# EAGLE design BusConPoly (EAGLE 6.6.0)
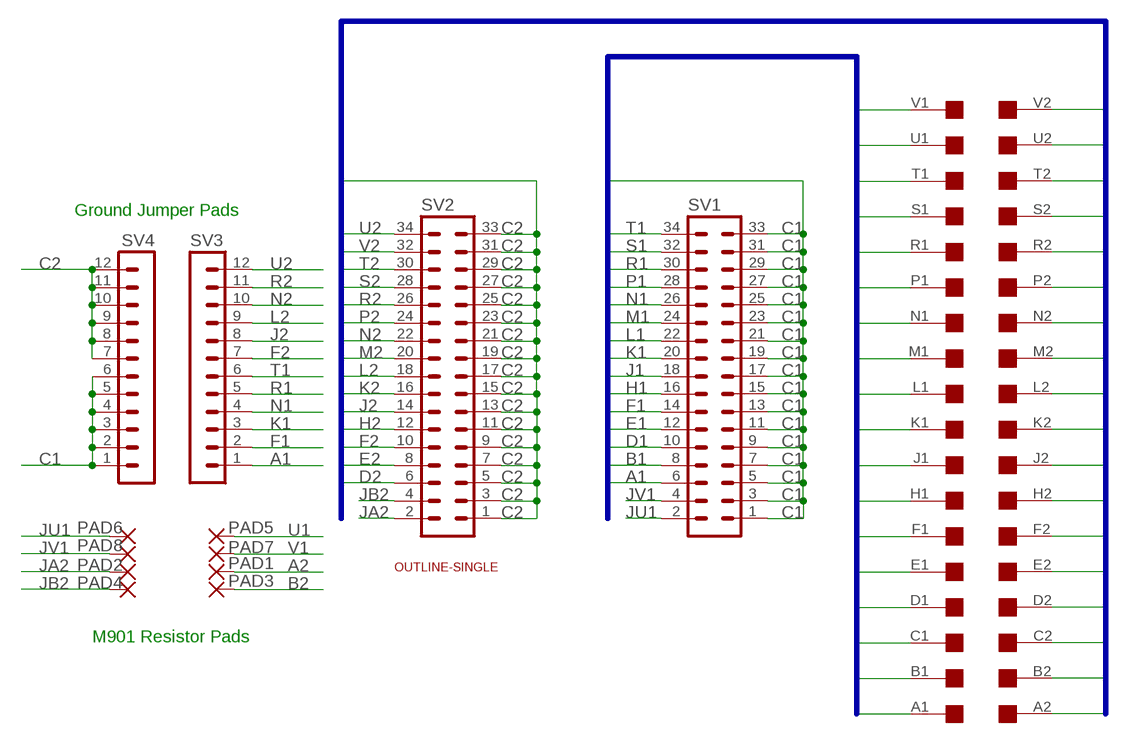
[diagram p0: schematic, sheet 1]

## Parts
PAD1  1,6/0,8  [1,6/0,8]
PAD2  1,6/0,8  [1,6/0,8]
PAD3  1,6/0,8  [1,6/0,8]
PAD4  1,6/0,8  [1,6/0,8]
PAD5  1,6/0,8  [1,6/0,8]
PAD6  1,6/0,8  [1,6/0,8]
PAD7  1,6/0,8  [1,6/0,8]
PAD8  1,6/0,8  [1,6/0,8]
SV1  MA17-2  [MA17-2]
SV2  MA17-2  [MA17-2]
SV3  MA12-1  [MA12-1]
SV4  MA12-1  [MA12-1]
U$1  OUTLINE-SINGLE  [SINGLE]
U$4  EDGE-2CONNECTOR  [EDGE-CON2]

## Nets
A1: SV1.6 SV3.1 U$4.A1
A2: PAD1.1(P) U$4.A2
B1: SV1.8 U$4.B1
B2: PAD3.1(P) U$4.B2
C1: SV1.1 SV1.3 SV1.5 SV1.7 SV1.9 SV1.11 SV1.13 SV1.15 SV1.17 SV1.19 SV1.21 SV1.23 SV1.25 SV1.27 SV1.29 SV1.31 SV1.33 SV4.1 SV4.2 SV4.3 SV4.4 SV4.5 SV4.6 U$4.C1
C2: SV2.1 SV2.3 SV2.5 SV2.7 SV2.9 SV2.11 SV2.13 SV2.15 SV2.17 SV2.19 SV2.21 SV2.23 SV2.25 SV2.27 SV2.29 SV2.31 SV2.33 SV4.7 SV4.8 SV4.9 SV4.10 SV4.11 SV4.12 U$4.C2
D1: SV1.10 U$4.D1
D2: SV2.6 U$4.D2
E1: SV1.12 U$4.E1
E2: SV2.8 U$4.E2
F1: SV1.14 SV3.2 U$4.F1
F2: SV2.10 SV3.7 U$4.F2
H1: SV1.16 U$4.H1
H2: SV2.12 U$4.H2
J1: SV1.18 U$4.J1
J2: SV2.14 SV3.8 U$4.J2
JA2: PAD2.1(P) SV2.2
JB2: PAD4.1(P) SV2.4
JU1: PAD6.1(P) SV1.2
JV1: PAD8.1(P) SV1.4
K1: SV1.20 SV3.3 U$4.K1
K2: SV2.16 U$4.K2
L1: SV1.22 U$4.L1
L2: SV2.18 SV3.9 U$4.L2
M1: SV1.24 U$4.M1
M2: SV2.20 U$4.M2
N1: SV1.26 SV3.4 U$4.N1
N2: SV2.22 SV3.10 U$4.N2
P1: SV1.28 U$4.P1
P2: SV2.24 U$4.P2
R1: SV1.30 SV3.5 U$4.R1
R2: SV2.26 SV3.11 U$4.R2
S1: SV1.32 U$4.S1
S2: SV2.28 U$4.S2
T1: SV1.34 SV3.6 U$4.T1
T2: SV2.30 U$4.T2
U1: PAD5.1(P) U$4.U1
U2: SV2.34 SV3.12 U$4.U2
V1: PAD7.1(P) U$4.V1
V2: SV2.32 U$4.V2

## Buses
A1,B1,C1,D1,E1,F1,H1,J1,K1,L1,M1,N1,P1,R1,S1,T1,U1,V1
A2,B2,C2,D2,E2,F2,H2,J2,K2,L2,M2,N2,P2,R2,S2,T2,U2,V2

## Notes on the sheet
- Ground Jumper Pads
- M901 Resistor Pads

## Library data of the parts
PAD1-PAD8 = wirepad:1,6/0,8: THROUGH-HOLE PAD
SV1 SV2 = con-lstb:MA17-2: PIN HEADER; OC_FARNELL: unknown; OC_NEWARK: unknown
SV3 SV4 = con-lstb:MA12-1: PIN HEADER; OC_FARNELL: unknown; OC_NEWARK: unknown
U$1 = dec-con:OUTLINE-*: Board outlines for DEC boards.
U$4 = dec-con:EDGE-2: Double-Sided DEC edge connector.

## Board
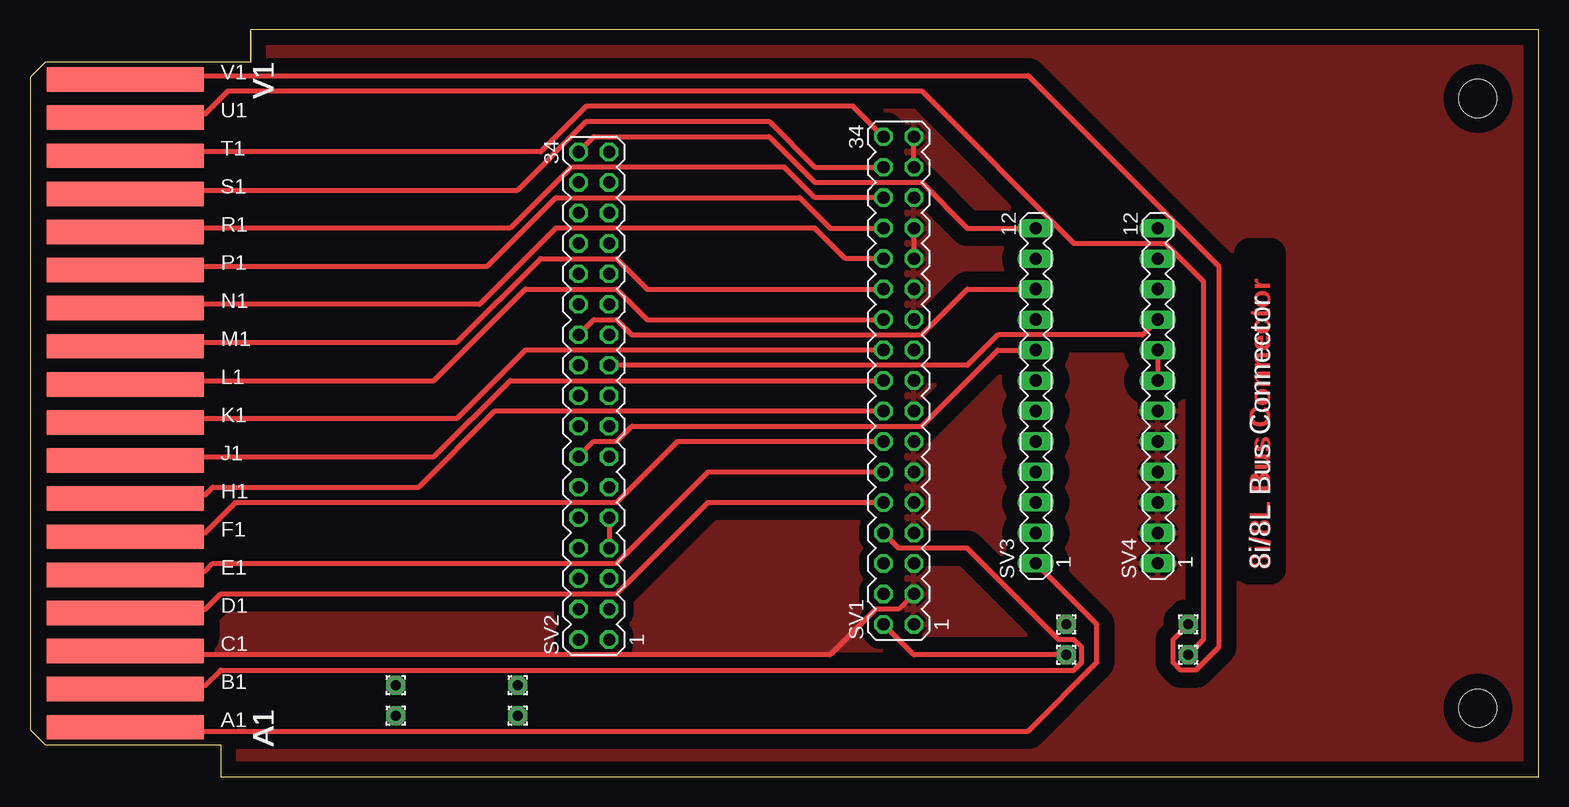
[diagram p1: board, top side]
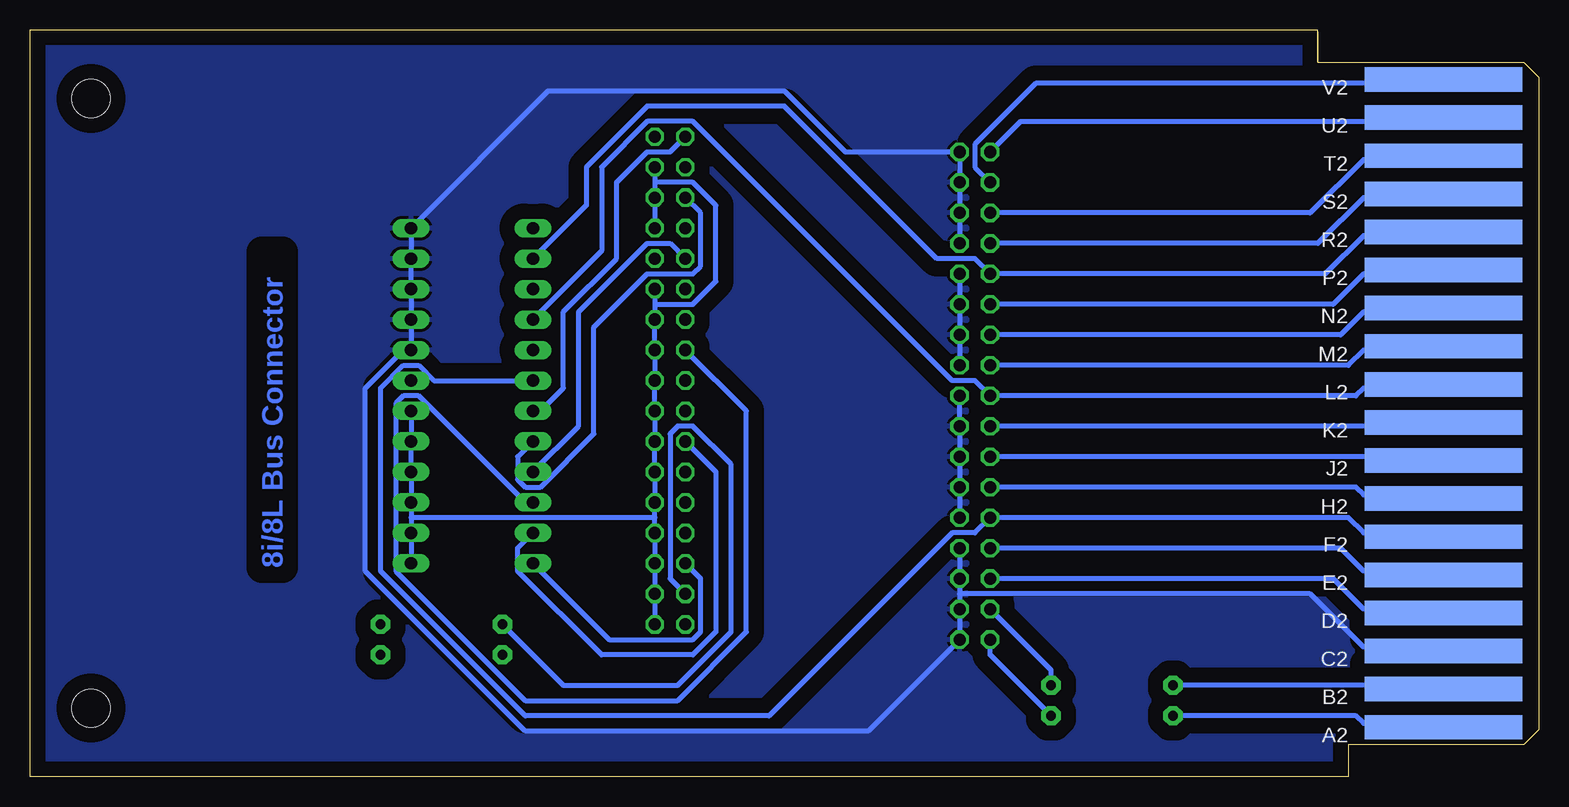
[diagram p2: board, bottom side, seen from below]

Size 125.73 x 62.23 mm. Coordinates in mm from the lower left corner, seen from the top.
Copper layers (1+16): Top 0.035mm / dielectric 1.5mm / Bottom 0.035mm
Design rules "16mils": minimum track width 16mil, minimum drill 32mil, track to track 15mil, track to pad 10mil, pad to pad 10mil, via to via 10mil, smd to smd 10mil, copper to edge 13mil, drill to drill 10mil, minimum pad ring 10mil, minimum via ring 8mil, stop-mask expansion 0mil, vias tented up to drill 0mil, thermal gap 10mil

### Footprints (pad centres in the part's own frame; a part is rotated, then mirrored left to right if it is on the bottom)
1,6/0,8 = drill 0.813 pad 1.6 octagon: 1 0,0
MA17-2 = drill 1.016 octagon: 1 -20.32,-1.27; 2 -20.32,1.27; 3 -17.78,-1.27; 4 -17.78,1.27; 5 -15.24,-1.27; 6 -15.24,1.27; 7 -12.7,-1.27; 8 -12.7,1.27; 9 -10.16,-1.27; 10 -10.16,1.27; 11 -7.62,-1.27; 12 -7.62,1.27; 13 -5.08,-1.27; 14 -5.08,1.27; 15 -2.54,-1.27; 16 -2.54,1.27; 17 0,-1.27; 18 0,1.27; 19 2.54,-1.27; 20 2.54,1.27; 21 5.08,-1.27; 22 5.08,1.27; 23 7.62,-1.27; 24 7.62,1.27; 25 10.16,-1.27; 26 10.16,1.27; 27 12.7,-1.27; 28 12.7,1.27; 29 15.24,-1.27; 30 15.24,1.27; 31 17.78,-1.27; 32 17.78,1.27; 33 20.32,-1.27; 34 20.32,1.27
MA12-1 = drill 1.016 long: 1 -13.97,0; 2 -11.43,0; 3 -8.89,0; 4 -6.35,0; 5 -3.81,0; 6 -1.27,0; 7 1.27,0; 8 3.81,0; 9 6.35,0; 10 8.89,0; 11 11.43,0; 12 13.97,0
SINGLE = hole 3.175: 120.65,56.515; 120.65,5.715
EDGE-CON2 = smd 13.106 x 2.032: A1 7.938,4.128; B1 7.938,7.303; C1 7.938,10.477; D1 7.938,13.652; E1 7.938,16.828; F1 7.938,20.003; H1 7.938,23.177; J1 7.938,26.352; K1 7.938,29.527; L1 7.938,32.703; M1 7.938,35.877; N1 7.938,39.053; P1 7.938,42.227; R1 7.938,45.403; S1 7.938,48.578; T1 7.938,51.752; U1 7.938,54.928; V1 7.938,58.102 | smd 13.106 x 2.032 bottom: A2 7.938,4.128; B2 7.938,7.303; C2 7.938,10.477; D2 7.938,13.652; E2 7.938,16.828; F2 7.938,20.003; H2 7.938,23.177; J2 7.938,26.352; K2 7.938,29.527; L2 7.938,32.703; M2 7.938,35.877; N2 7.938,39.053; P2 7.938,42.227; R2 7.938,45.403; S2 7.938,48.578; T2 7.938,51.752; U2 7.938,54.928; V2 7.938,58.102

### Placement (x,y rotation side)
PAD1  30.48,5.08 0 top
PAD2  40.64,5.08 0 top
PAD3  30.48,7.62 0 top
PAD4  40.64,7.62 0 top
PAD5  96.52,10.16 180 top
PAD6  86.36,10.16 180 top
PAD7  96.52,12.7 180 top
PAD8  86.36,12.7 180 top
SV1  72.39,33.02 90 top
SV2  46.99,31.75 90 top
SV3  83.82,31.75 90 top
SV4  93.98,31.75 90 top
U$1  0,0 0 top
U$4  0,0 0 top

### Tracks (layer width: path | path; a pad name or v marks a point on that pad's centre or on a via)
A1
  Top 0.406: SV3.1 88.9,12.7 88.9,9.53 83.19,3.81 8.26,3.81 U$4.A1
  Bottom 0.406: SV1.6 69.85,16.51 69.85,12.06 70.49,11.43 77.47,11.43 SV3.1
A2
  Bottom 0.406: PAD1.1 15.24,5.08 14.61,4.45 8.26,4.45 U$4.A2
B1
  Top 0.406: SV1.8 72.39,19.05 78.11,19.05 85.73,11.43 87,11.43 87.63,10.79 87.63,9.53 87,8.89 15.88,8.89 14.61,7.62 8.26,7.62 U$4.B1
B2
  Bottom 0.406: PAD3.1 8.26,7.62 U$4.B2
C1
  Top 0.406: SV1.27 SV1.25 | SV1.31 SV1.33 | SV1.3 72.39,13.97 70.49,13.97 66.68,10.16 8.26,10.16 U$4.C1
  Bottom 0.406: SV4.6 SV4.5 SV4.4 SV4.3 93.98,21.59 | SV4.1 SV4.2 93.98,21.59 | SV1.31 73.66,49.53 | 73.66,49.53 SV1.29 SV1.27 | SV1.23 73.66,39.37 | 73.66,39.37 SV1.21 SV1.19 SV1.17 SV1.15 SV1.13 SV1.11 SV1.9 73.66,21.59 | SV1.1 SV1.3 SV1.5 SV1.7 73.66,21.59 | 73.66,49.53 70.49,49.53 68.58,47.62 68.58,41.27 70.49,39.37 73.66,39.37 | 73.66,21.59 93.98,21.59
  pour Top (isolate 1.27): 15.24,0 15.24,62.23 125.73,62.23 125.73,0
C2
  Top 0.406: SV4.8 SV4.7 | SV2.19 78.11,34.29 80.65,36.83 92.71,36.83 SV4.9 | SV2.9 SV2.7
  Bottom 0.406: SV2.27 SV2.29 SV2.31 SV2.33 57.79,52.07 62.87,57.15 82.55,57.15 SV4.12 SV4.11 SV4.10 SV4.9 SV4.8 94.62,35.56 97.79,32.38 97.79,17.14 84.46,3.81 55.88,3.81 SV2.1 SV2.3 48.26,15.24 | SV2.19 SV2.21 SV2.23 SV2.25 | SV2.7 SV2.5 48.26,15.24 | SV2.9 SV2.11 SV2.13 SV2.15 SV2.17 | 48.26,15.24 19.05,15.24 14.61,10.79 8.26,10.79 U$4.C2
  pour Bottom (isolate 1.27): 15.24,62.23 125.73,62.23 125.73,0 15.24,0
D1
  Top 0.406: SV1.10 56.52,22.86 48.9,15.24 15.88,15.24 14.61,13.97 8.26,13.97 U$4.D1
D2
  Bottom 0.406: SV2.6 17.15,16.51 14.61,13.97 8.26,13.97 U$4.D2
E1
  Top 0.406: SV1.12 56.52,25.4 48.9,17.78 15.24,17.78 14.61,17.14 8.26,17.14 U$4.E1
E2
  Bottom 0.406: SV2.8 16.51,19.05 14.61,17.14 8.26,17.14 U$4.E2
F1
  Top 0.406: SV1.14 53.98,27.94 48.9,22.86 17.15,22.86 14.61,20.32 8.26,20.32 U$4.F1
  Bottom 0.406: SV3.2 85.09,19.05 85.09,17.14 78.11,10.16 70.49,10.16 68.58,12.06 68.58,25.4 SV1.14
F2
  Bottom 0.406: U$4.F2 8.26,20.32 14.61,20.32 15.88,21.59 SV2.10 46.99,20.32 48.9,20.32 64.14,5.08 84.46,5.08 96.52,17.14 96.52,32.38 94.62,34.29 93.35,34.29 92.08,33.02 SV3.7
H1
  Top 0.406: SV1.16 38.74,30.48 32.39,24.13 15.24,24.13 14.61,23.5 8.26,23.5 U$4.H1
H2
  Bottom 0.406: SV2.12 15.24,24.13 14.61,23.5 8.26,23.5 U$4.H2
J1
  Top 0.406: SV1.18 40.01,33.02 33.66,26.67 8.26,26.67 U$4.J1
J2
  Top 0.406: SV3.8 80.65,35.56 74.3,29.21 50.17,29.21 48.9,27.94 46.99,27.94 SV2.14
  Bottom 0.406: SV2.14 8.26,26.67 U$4.J2
JA2
  Bottom 0.406: SV2.2 45.72,10.16 PAD2.1
JB2
  Bottom 0.406: SV2.4 40.64,8.89 PAD4.1
JU1
  Top 0.406: SV1.2 73.66,10.16 PAD6.1
JV1
  Bottom 0.406: SV1.4 72.39,16.51 72.39,28.57 71.76,29.21 70.49,29.21 67.31,26.04 67.31,12.06 71.76,7.62 81.28,7.62 PAD8.1
K1
  Top 0.406: SV1.20 41.28,35.56 35.56,29.84 8.26,29.84 U$4.K1
  Bottom 0.406: SV1.20 66.04,30.48 66.04,12.06 71.76,6.35 84.46,6.35 95.25,17.14 95.25,31.11 94.62,31.75 93.35,31.75 84.46,22.86 SV3.3
K2
  Bottom 0.406: SV2.16 8.26,29.21 U$4.K2
L1
  Top 0.406: SV1.22 51.44,38.1 48.9,40.64 41.28,40.64 33.66,33.02 8.26,33.02 U$4.L1
L2
  Bottom 0.406: U$4.L2 8.26,32.38 14.61,32.38 15.24,31.75 SV2.18 46.99,33.02 48.9,33.02 70.49,54.61 74.3,54.61 78.11,50.8 78.11,43.81 SV3.9
M1
  Top 0.406: SV1.24 51.44,40.64 48.9,43.18 42.55,43.18 35.56,36.2 8.26,36.2 U$4.M1
M2
  Bottom 0.406: SV2.20 15.88,34.29 14.61,35.56 8.26,35.56 U$4.M2
N1
  Top 0.406: SV1.26 67.95,43.18 65.41,45.72 43.82,45.72 37.47,39.37 8.26,39.37 U$4.N1
  Bottom 0.406: SV1.26 72.39,44.45 74.3,44.45 80.01,38.73 80.01,29.21 SV3.4
N2
  Top 0.406: SV3.10 78.11,40.64 74.3,36.83 50.17,36.83 48.9,38.1 46.99,38.1 SV2.22
  Bottom 0.406: SV2.22 16.51,36.83 14.61,38.73 8.26,38.73 U$4.N2
P1
  Top 0.406: SV1.28 66.68,45.72 64.14,48.26 43.82,48.26 38.1,42.55 8.26,42.55 U$4.P1
P2
  Bottom 0.406: SV2.24 17.15,39.37 14.61,41.91 8.26,41.91 U$4.P2
R1
  Top 0.406: SV1.30 65.41,48.26 62.87,50.8 45.09,50.8 40.01,45.72 8.26,45.72 U$4.R1
  Bottom 0.406: SV1.30 69.85,46.99 69.85,42.55 70.49,41.91 74.3,41.91 78.74,37.47 78.74,28.57 83.19,24.13 84.46,24.13 85.09,24.77 85.09,26.67 SV3.5
R2
  Bottom 0.406: U$4.R2 8.26,45.09 14.61,45.09 17.78,41.91 SV2.26 46.99,43.18 50.17,43.18 62.87,55.88 74.3,55.88 79.38,50.8 79.38,47.62 SV3.11
S1
  Top 0.406: SV1.32 65.41,50.8 61.6,54.61 46.36,54.61 40.64,48.9 8.26,48.9 U$4.S1
S2
  Bottom 0.406: SV2.28 18.42,44.45 14.61,48.26 8.26,48.26 U$4.S2
T1
  Top 0.406: SV1.34 68.58,55.88 46.36,55.88 42.55,52.07 8.26,52.07 U$4.T1
  Bottom 0.406: SV1.34 72.39,52.07 74.3,52.07 76.84,49.53 76.84,43.18 81.28,38.73 81.28,32.38 83.19,30.48 SV3.6
T2
  Bottom 0.406: SV2.30 19.05,46.99 14.61,51.44 8.26,51.44 U$4.T2
U1
  Top 0.406: PAD5.1 97.79,11.43 97.79,41.27 94.62,44.45 87,44.45 74.3,57.15 16.51,57.15 14.61,55.24 8.26,55.24 U$4.U1
U2
  Top 0.406: SV3.12 78.11,45.72 74.3,49.53 65.41,49.53 61.6,53.34 46.99,53.34 SV2.34
  Bottom 0.406: SV2.34 43.18,54.61 8.26,54.61 U$4.U2
V1
  Top 0.406: PAD7.1 95.25,11.43 95.25,9.53 95.89,8.89 97.16,8.89 99.06,10.79 99.06,42.55 83.19,58.42 8.26,58.42 U$4.V1
V2
  Bottom 0.406: SV2.32 46.99,50.8 46.99,52.7 41.91,57.78 8.26,57.78 U$4.V2

### Text on the board
Top: 8i/8L Bus Connector
Bottom: 8i/8L Bus Connector
tPlace: 8i/8L Bus Connector
tNames: V1 | V1 | V1 | V1 | V1 | V1 | V1 | V1 | V1 | V1 | V1 | V1 | V1 | V1 | V1 | V1 | V1 | V1 | V1 | V1 | V1 | V1 | V1 | V1 | V1 | V1 | V1 | V1 | V1 | V1 | V1 | V1 | A1 | A1 | A1 | A1 | A1 | A1 | A1 | A1 | A1 | A1 | A1 | A1 | A1 | A1 | A1 | A1 | A1 | A1 | A1 | A1 | A1 | A1 | A1 | A1 | A1 | A1 | A1 | A1 | A1 | A1 | A1 | A1
tValues: Jumper unless M901 | M90x/W0x1 - always used | M901/M903/M904 - Use both | M901 | 10ohm | M901 | 10ohm